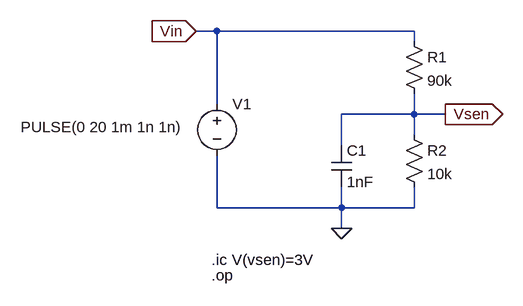
[diagram p0: schematic Operating_Point.asc]
Operating_Point.asc, the LTspice schematic file:
Version 4
SHEET 1 880 680
WIRE 64 0 32 0
WIRE 368 0 64 0
WIRE 368 16 368 0
WIRE 64 112 64 0
WIRE 368 128 368 96
WIRE 368 128 256 128
WIRE 416 128 368 128
WIRE 368 160 368 128
WIRE 256 176 256 128
WIRE 64 272 64 192
WIRE 256 272 256 240
WIRE 256 272 64 272
WIRE 368 272 368 240
WIRE 368 272 256 272
WIRE 256 304 256 272
FLAG 256 304 0
FLAG 32 0 Vin
IOPIN 32 0 In
FLAG 416 128 Vsen
IOPIN 416 128 Out
SYMBOL voltage 64 96 R0
WINDOW 3 -302 52 Left 2
WINDOW 123 0 0 Left 0
WINDOW 39 0 0 Left 0
SYMATTR InstName V1
SYMATTR Value PULSE(0 20 1m 1n 1n)
SYMBOL res 352 0 R0
SYMATTR InstName R1
SYMATTR Value 90k
SYMBOL res 352 144 R0
SYMATTR InstName R2
SYMATTR Value 10k
SYMBOL cap 240 176 R0
SYMATTR InstName C1
SYMATTR Value 1nF
TEXT 56 376 Left 2 !.op
TEXT 56 352 Left 2 !.ic V(vsen)=3V

The netlist it stands for:
* Operating_Point.asc
V1 Vin 0 PULSE(0 20 1m 1n 1n)
R1 Vin Vsen 90k
R2 Vsen 0 10k
C1 Vsen 0 1nF
.op
.ic V(vsen)=3V
.backanno
.end

* Results of the author's LTspice run, read from the files saved beside the schematic
* Operating Point:
*   V(vin) = 0 V
*   V(vsen) = 3 V
*   I(C1) = 0 A
*   I(R2) = 300 µA
*   I(R1) = -33.33 µA
*   I(V1) = 33.33 µA